# Altium schematic sheet reTerm-HW-M-IOLINK-MAIN.SchDoc: reTerm IOLINK MAIN
size A; DocumentNumber: 1; Revision: 1.0.0; SheetNumber: 1; SheetTotal: 4
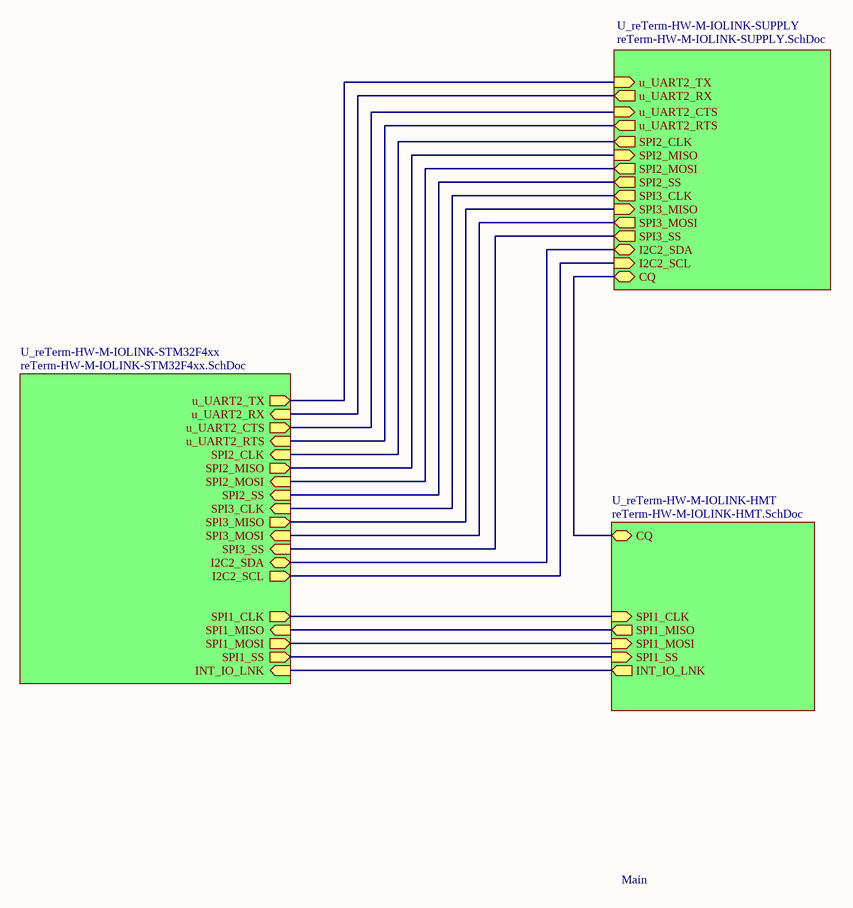
[diagram p0: reTerm-HW-M-IOLINK-MAIN.SchDoc]

## Sub-sheets
U_reTerm-HW-M-IOLINK-HMT = reTerm-HW-M-IOLINK-HMT.SchDoc: SPI1_SS (in), SPI1_MOSI (in), SPI1_MISO (out), SPI1_CLK (in), INT_IO_LNK (out), CQ (bidir)
U_reTerm-HW-M-IOLINK-STM32F4xx = reTerm-HW-M-IOLINK-STM32F4xx.SchDoc: SPI1_CLK (out), SPI1_MISO (in), SPI1_MOSI (out), u_UART2_TX (out), u_UART2_RX (in), SPI1_SS (out), INT_IO_LNK (in), SPI2_CLK (in), SPI2_MISO (out), SPI2_MOSI (in), SPI2_SS (in), u_UART2_CTS (out), u_UART2_RTS (in), SPI3_CLK (in), SPI3_MISO (out), SPI3_MOSI (in), SPI3_SS (in), I2C2_SCL (out), I2C2_SDA (bidir)
U_reTerm-HW-M-IOLINK-SUPPLY = reTerm-HW-M-IOLINK-SUPPLY.SchDoc: CQ (bidir), u_UART2_TX (in), u_UART2_RX (out), SPI2_CLK (out), SPI2_MISO (in), SPI2_MOSI (out), SPI2_SS (out), u_UART2_CTS (in), u_UART2_RTS (out), SPI3_CLK (out), SPI3_MISO (in), SPI3_MOSI (out), SPI3_SS (out), I2C2_SDA (bidir), I2C2_SCL (in)

## Nets
(unnamed): sheet U_reTerm-HW-M-IOLINK-STM32F4xx/SPI1_CLK, sheet U_reTerm-HW-M-IOLINK-HMT/SPI1_CLK
(unnamed): sheet U_reTerm-HW-M-IOLINK-STM32F4xx/SPI1_MISO, sheet U_reTerm-HW-M-IOLINK-HMT/SPI1_MISO
(unnamed): sheet U_reTerm-HW-M-IOLINK-STM32F4xx/SPI1_MOSI, sheet U_reTerm-HW-M-IOLINK-HMT/SPI1_MOSI
(unnamed): sheet U_reTerm-HW-M-IOLINK-STM32F4xx/u_UART2_TX, sheet U_reTerm-HW-M-IOLINK-SUPPLY/u_UART2_TX
(unnamed): sheet U_reTerm-HW-M-IOLINK-STM32F4xx/u_UART2_RX, sheet U_reTerm-HW-M-IOLINK-SUPPLY/u_UART2_RX
(unnamed): sheet U_reTerm-HW-M-IOLINK-STM32F4xx/SPI1_SS, sheet U_reTerm-HW-M-IOLINK-HMT/SPI1_SS
(unnamed): sheet U_reTerm-HW-M-IOLINK-STM32F4xx/INT_IO_LNK, sheet U_reTerm-HW-M-IOLINK-HMT/INT_IO_LNK
(unnamed): sheet U_reTerm-HW-M-IOLINK-STM32F4xx/SPI2_CLK, sheet U_reTerm-HW-M-IOLINK-SUPPLY/SPI2_CLK
(unnamed): sheet U_reTerm-HW-M-IOLINK-STM32F4xx/SPI2_MISO, sheet U_reTerm-HW-M-IOLINK-SUPPLY/SPI2_MISO
(unnamed): sheet U_reTerm-HW-M-IOLINK-STM32F4xx/SPI2_MOSI, sheet U_reTerm-HW-M-IOLINK-SUPPLY/SPI2_MOSI
(unnamed): sheet U_reTerm-HW-M-IOLINK-STM32F4xx/SPI2_SS, sheet U_reTerm-HW-M-IOLINK-SUPPLY/SPI2_SS
(unnamed): sheet U_reTerm-HW-M-IOLINK-STM32F4xx/u_UART2_CTS, sheet U_reTerm-HW-M-IOLINK-SUPPLY/u_UART2_CTS
(unnamed): sheet U_reTerm-HW-M-IOLINK-STM32F4xx/u_UART2_RTS, sheet U_reTerm-HW-M-IOLINK-SUPPLY/u_UART2_RTS
(unnamed): sheet U_reTerm-HW-M-IOLINK-STM32F4xx/SPI3_CLK, sheet U_reTerm-HW-M-IOLINK-SUPPLY/SPI3_CLK
(unnamed): sheet U_reTerm-HW-M-IOLINK-STM32F4xx/SPI3_MISO, sheet U_reTerm-HW-M-IOLINK-SUPPLY/SPI3_MISO
(unnamed): sheet U_reTerm-HW-M-IOLINK-STM32F4xx/SPI3_MOSI, sheet U_reTerm-HW-M-IOLINK-SUPPLY/SPI3_MOSI
(unnamed): sheet U_reTerm-HW-M-IOLINK-STM32F4xx/SPI3_SS, sheet U_reTerm-HW-M-IOLINK-SUPPLY/SPI3_SS
(unnamed): sheet U_reTerm-HW-M-IOLINK-STM32F4xx/I2C2_SCL, sheet U_reTerm-HW-M-IOLINK-SUPPLY/I2C2_SCL
(unnamed): sheet U_reTerm-HW-M-IOLINK-STM32F4xx/I2C2_SDA, sheet U_reTerm-HW-M-IOLINK-SUPPLY/I2C2_SDA
(unnamed): sheet U_reTerm-HW-M-IOLINK-HMT/CQ, sheet U_reTerm-HW-M-IOLINK-SUPPLY/CQ

## Notes on the sheet
- Main